# Altium schematic sheet DM2097_TopLevel.SchDoc: =project_title
size Tabloid; PageSetup: Record=PageOptions|CenterHorizontal=True|CenterVertical=True|PrintScale=0.73|XCorrection=1.00|YCorrection=1.00|PrintKind=0|BorderSize=5000000|LeftOffset=0|BottomOffset=0|Orientation=2|PaperLength=1000|PaperWidth=1000|Scale=100|PaperSource=7|PrintQuality=-4|MediaType=1|DitherType=10|PaperKind=A4|PrintScaleMode=1; CompanyName: Luxonis Holding; Organization: Luxonis Holding; Address1: 1925 Harmony Park Drive; Address2: Westminster, CO; Address3: 80234; Address4: United States; SheetNumber: 2; SheetTotal: 17
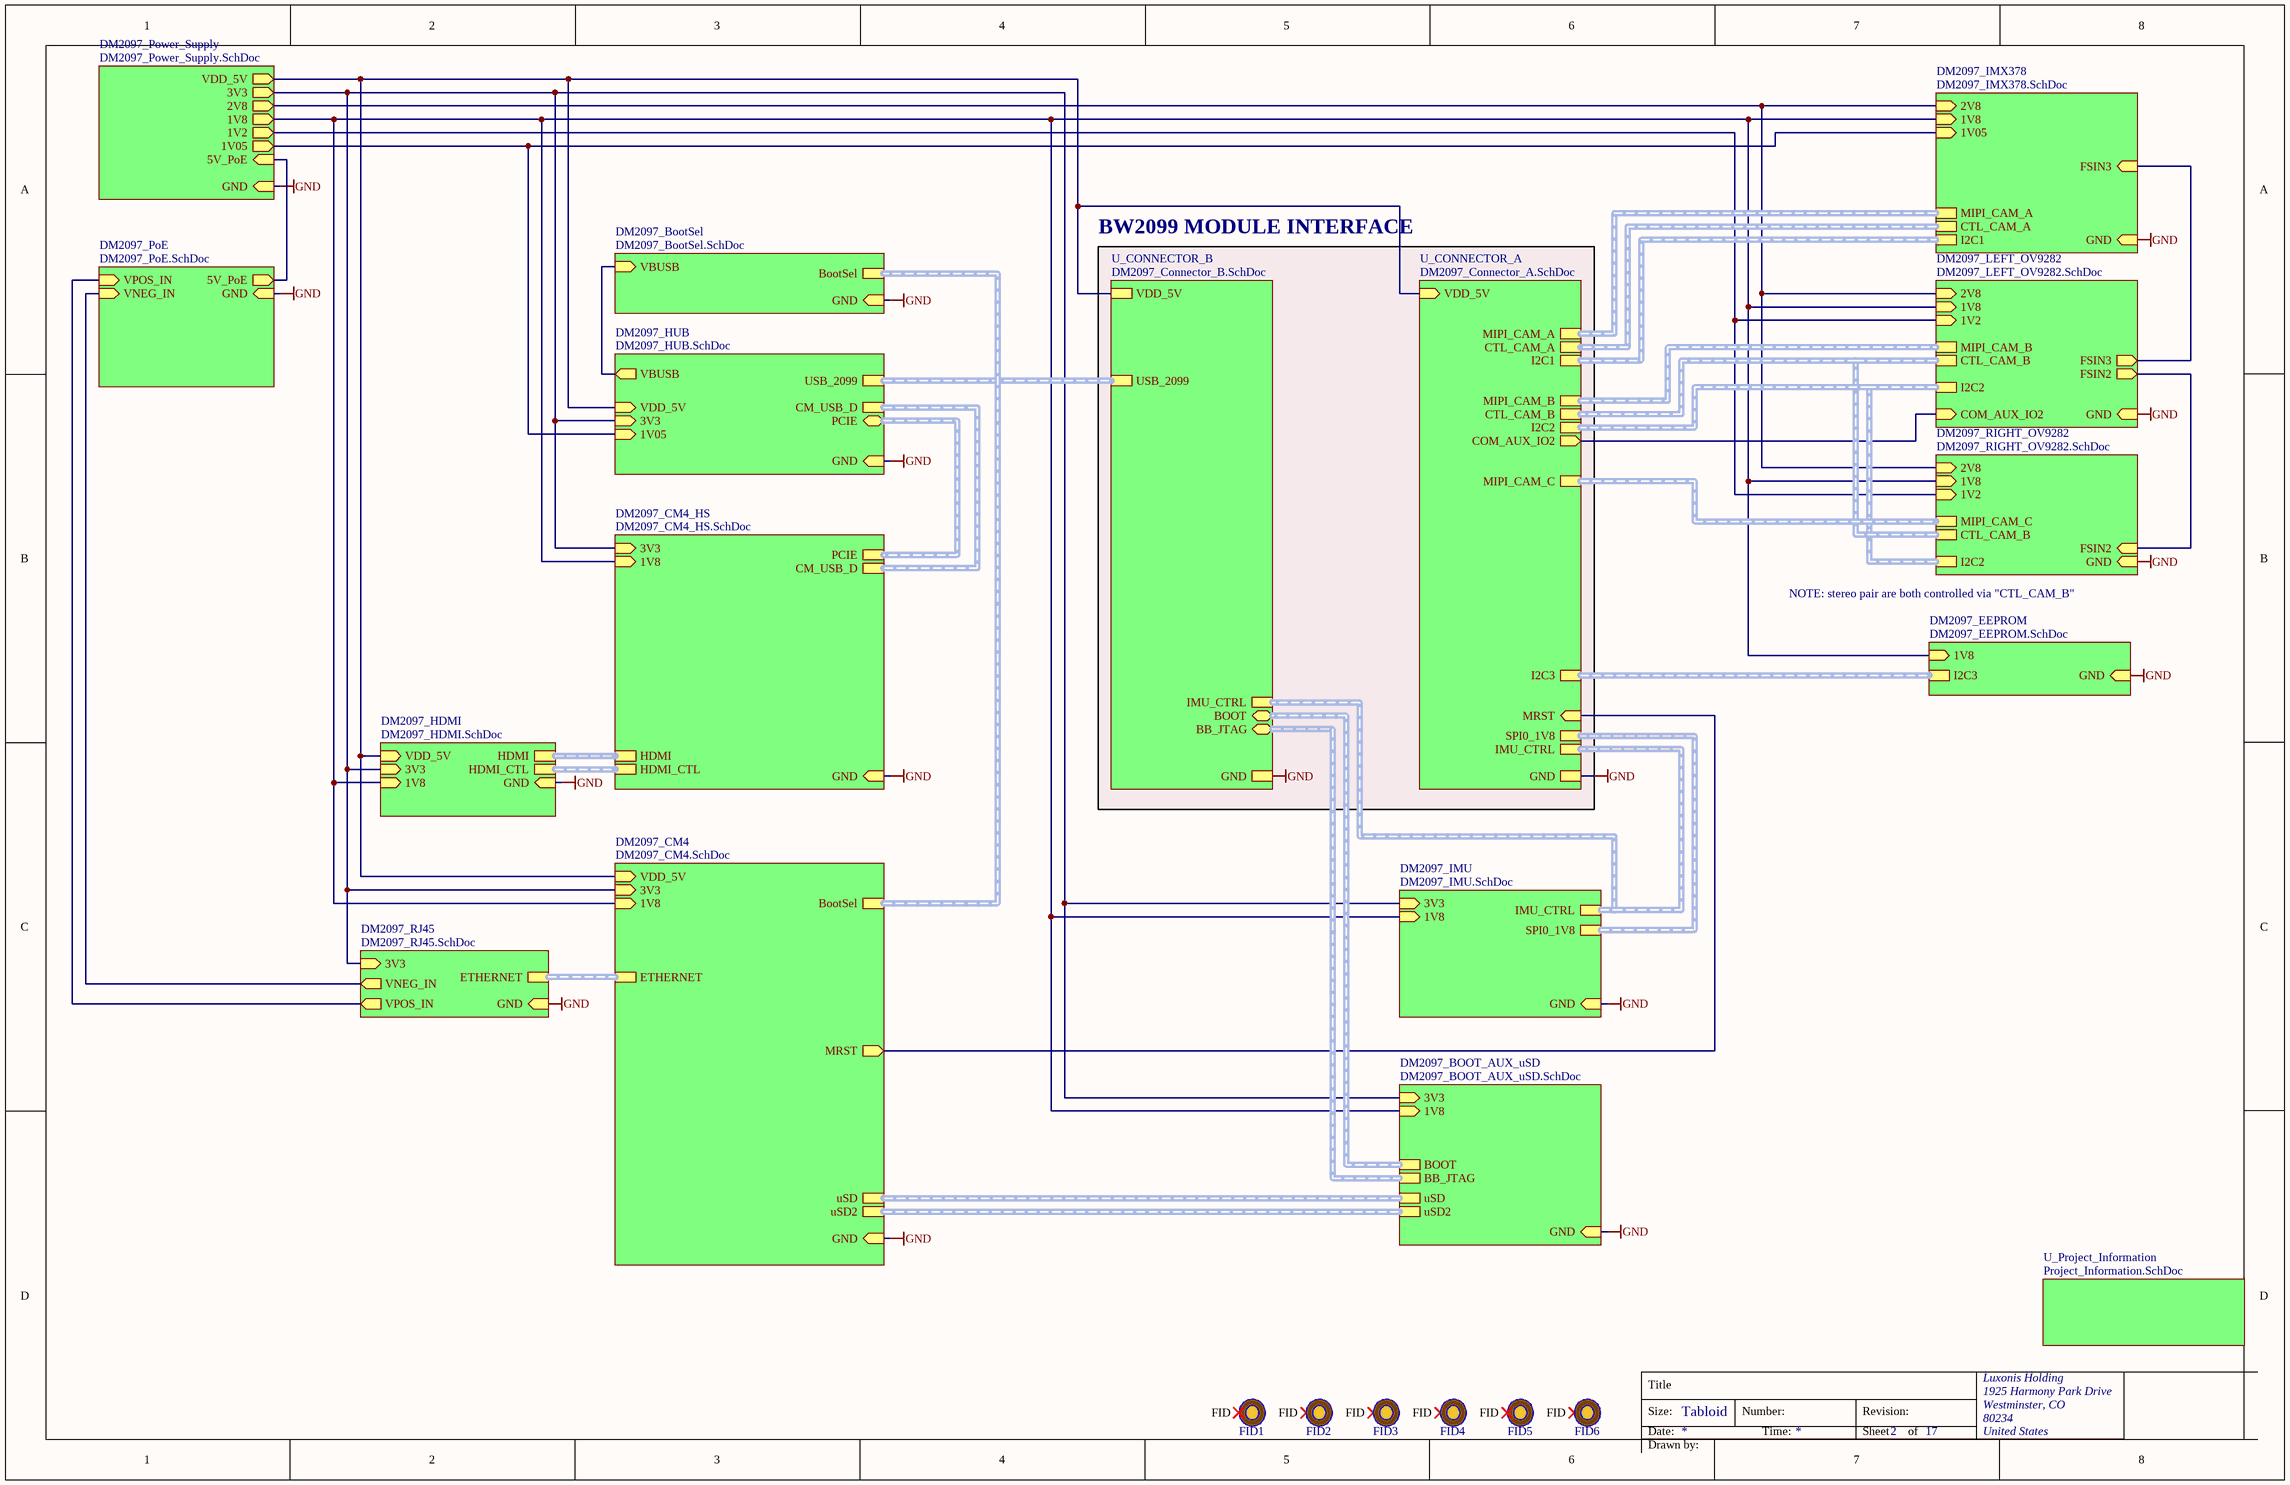
[diagram p0: DM2097_TopLevel.SchDoc]

## Parts
FID1  FIDUCIAL_ROUND_1MM  [FIDUCIAL_ROUND_1MM]  (value not drawn)  (no BOM)
FID2  FIDUCIAL_ROUND_1MM  [FIDUCIAL_ROUND_1MM]  (value not drawn)  (no BOM)
FID3  FIDUCIAL_ROUND_1MM  [FIDUCIAL_ROUND_1MM]  (value not drawn)  (no BOM)
FID4  FIDUCIAL_ROUND_1MM  [FIDUCIAL_ROUND_1MM]  (value not drawn)  (no BOM)
FID5  FIDUCIAL_ROUND_1MM  [FIDUCIAL_ROUND_1MM]  (value not drawn)  (no BOM)
FID6  FIDUCIAL_ROUND_1MM  [FIDUCIAL_ROUND_1MM]  (value not drawn)  (no BOM)

## Sub-sheets
DM2097_BOOT_AUX_uSD = DM2097_BOOT_AUX_uSD.SchDoc: uSD (harness uSD), 3V3 (in), GND (in), BB_JTAG (harness uSD), BOOT (harness uSD), 1V8 (in), uSD2
DM2097_BootSel = DM2097_BootSel.SchDoc: VBUSB (in), BootSel (harness BootSel), GND (in)
DM2097_CM4 = DM2097_CM4.SchDoc: GND (in), 3V3 (in), VDD_5V (in), BootSel (harness BootSel), ETHERNET (harness ETHERNET), 1V8 (in), MRST (out), uSD, uSD2
DM2097_CM4_HS = DM2097_CM4_HS.SchDoc: HDMI (harness HDMI), HDMI_CTL (harness HDMI_CTL), GND (in), CM_USB_D, PCIE (harness PCIE), 3V3 (in), 1V8 (in)
DM2097_EEPROM = DM2097_EEPROM.SchDoc: GND (in), 1V8 (in), I2C3
DM2097_HDMI = DM2097_HDMI.SchDoc: HDMI_CTL (harness HDMI_CTL), HDMI (harness HDMI), 3V3 (in), GND (in), VDD_5V (in), 1V8 (in)
DM2097_HUB = DM2097_HUB.SchDoc: CM_USB_D (harness CM _USB_D), USB_2099 (harness USB_M), VDD_5V (in), 3V3 (in), GND (in), VBUSB (out), PCIE (bidir, harness Harness), 1V05 (in)
DM2097_IMU = DM2097_IMU.SchDoc: 3V3 (in), GND (in), SPI0_1V8 (harness uSD), 1V8 (in), IMU_CTRL (harness uSD)
DM2097_IMX378 = DM2097_IMX378.SchDoc: 2V8 (in), 1V05 (in), I2C1 (harness I2C1), MIPI_CAM_A (harness MIPI_CAM_A), CTL_CAM_A (harness CTL_CAM_A), GND (in), 1V8 (in), FSIN3 (in)
DM2097_LEFT_OV9282 = DM2097_LEFT_OV9282.SchDoc: I2C2 (harness I2C2), CTL_CAM_B (harness CTL_CAM_B), MIPI_CAM_B (harness MIPI_CAM_B), 1V2 (in), 2V8 (in), GND (in), 1V8 (in), FSIN2 (out), COM_AUX_IO2 (in), FSIN3 (out)
DM2097_PoE = DM2097_PoE.SchDoc: VNEG_IN (in), VPOS_IN (in), 5V_PoE (out), GND (in)
DM2097_Power_Supply = DM2097_Power_Supply.SchDoc: 1V8 (out), 2V8 (out), 1V05 (out), VDD_5V (out), GND (in), 3V3 (out), 1V2 (out), 5V_PoE (in)
DM2097_RIGHT_OV9282 = DM2097_RIGHT_OV9282.SchDoc: I2C2 (harness I2C2), 1V2 (in), 2V8 (in), GND (in), 1V8 (in), FSIN2 (in), MIPI_CAM_C (harness MIPI_CAM_C), CTL_CAM_B (harness CTL_CAM_B)
DM2097_RJ45 = DM2097_RJ45.SchDoc: 3V3 (in), ETHERNET (harness ETHERNET), GND (in), VNEG_IN (out), VPOS_IN (out)
U_CONNECTOR_A = DM2097_Connector_A.SchDoc: I2C2 (harness I2C2), I2C1 (harness I2C1), MIPI_CAM_C (harness MIPI_CAM_C), CTL_CAM_A (harness CTL_CAM_A), MIPI_CAM_A (harness MIPI_CAM_A), MIPI_CAM_B (harness MIPI_CAM_B), GND, CTL_CAM_B (harness CTL_CAM_B), COM_AUX_IO2 (out), MRST (in), SPI0_1V8, VDD_5V (in), IMU_CTRL, I2C3 (harness I2C1)
U_CONNECTOR_B = DM2097_Connector_B.SchDoc: VDD_5V, GND, BOOT (bidir, harness BOOT), BB_JTAG (bidir, harness BB_JTAG), USB_2099, IMU_CTRL
U_Project_Information = Project_Information.SchDoc: no entries

## Nets
GND: sheet DM2097_IMX378/GND, sheet DM2097_CM4/GND, sheet DM2097_BOOT_AUX_uSD/GND, sheet DM2097_BootSel/GND, sheet DM2097_HUB/GND, sheet DM2097_RJ45/GND, sheet DM2097_RIGHT_OV9282/GND, sheet DM2097_LEFT_OV9282/GND, sheet DM2097_Power_Supply/GND, sheet DM2097_HDMI/GND, sheet DM2097_CM4_HS/GND, sheet DM2097_PoE/GND, sheet U_CONNECTOR_B/GND, sheet U_CONNECTOR_A/GND, sheet DM2097_IMU/GND, sheet DM2097_EEPROM/GND
(unnamed): sheet DM2097_IMX378/2V8, sheet DM2097_RIGHT_OV9282/2V8, sheet DM2097_LEFT_OV9282/2V8, sheet DM2097_Power_Supply/2V8
(unnamed): sheet DM2097_IMX378/1V05, sheet DM2097_HUB/1V05, sheet DM2097_Power_Supply/1V05
(unnamed): sheet DM2097_IMX378/1V8, sheet DM2097_CM4/1V8, sheet DM2097_BOOT_AUX_uSD/1V8, sheet DM2097_RIGHT_OV9282/1V8, sheet DM2097_LEFT_OV9282/1V8, sheet DM2097_Power_Supply/1V8, sheet DM2097_HDMI/1V8, sheet DM2097_CM4_HS/1V8, sheet DM2097_IMU/1V8, sheet DM2097_EEPROM/1V8
(unnamed): sheet DM2097_IMX378/FSIN3, sheet DM2097_LEFT_OV9282/FSIN3
(unnamed): sheet DM2097_CM4/3V3, sheet DM2097_BOOT_AUX_uSD/3V3, sheet DM2097_HUB/3V3, sheet DM2097_RJ45/3V3, sheet DM2097_Power_Supply/3V3, sheet DM2097_HDMI/3V3, sheet DM2097_CM4_HS/3V3, sheet DM2097_IMU/3V3
(unnamed): sheet DM2097_CM4/VDD_5V, sheet DM2097_HUB/VDD_5V, sheet DM2097_Power_Supply/VDD_5V, sheet DM2097_HDMI/VDD_5V, sheet U_CONNECTOR_B/VDD_5V, sheet U_CONNECTOR_A/VDD_5V
(unnamed): sheet DM2097_CM4/MRST, sheet U_CONNECTOR_A/MRST
(unnamed): sheet DM2097_BootSel/VBUSB, sheet DM2097_HUB/VBUSB
(unnamed): sheet DM2097_RJ45/VNEG_IN, sheet DM2097_PoE/VNEG_IN
(unnamed): sheet DM2097_RJ45/VPOS_IN, sheet DM2097_PoE/VPOS_IN
(unnamed): sheet DM2097_RIGHT_OV9282/1V2, sheet DM2097_LEFT_OV9282/1V2, sheet DM2097_Power_Supply/1V2
(unnamed): sheet DM2097_RIGHT_OV9282/FSIN2, sheet DM2097_LEFT_OV9282/FSIN2
(unnamed): sheet DM2097_LEFT_OV9282/COM_AUX_IO2, sheet U_CONNECTOR_A/COM_AUX_IO2
(unnamed): sheet DM2097_Power_Supply/5V_PoE, sheet DM2097_PoE/5V_PoE

Not connected (* = marked no-connect by the designer): FID1 FID*; FID2 FID*; FID3 FID*; FID4 FID*; FID5 FID*; FID6 FID*

## Buses and harness runs
harness sheet DM2097_BOOT_AUX_uSD/BB_JTAG = sheet U_CONNECTOR_B/BB_JTAG
harness sheet DM2097_BOOT_AUX_uSD/BOOT = sheet U_CONNECTOR_B/BOOT
harness sheet DM2097_BOOT_AUX_uSD/uSD2 = sheet DM2097_CM4/uSD2
harness sheet DM2097_BOOT_AUX_uSD/uSD = sheet DM2097_CM4/uSD
harness sheet DM2097_BootSel/BootSel = sheet DM2097_CM4/BootSel
harness sheet DM2097_CM4/ETHERNET = sheet DM2097_RJ45/ETHERNET
harness sheet DM2097_CM4_HS/CM_USB_D = sheet DM2097_HUB/CM_USB_D
harness sheet DM2097_CM4_HS/HDMI = sheet DM2097_HDMI/HDMI
harness sheet DM2097_CM4_HS/HDMI_CTL = sheet DM2097_HDMI/HDMI_CTL
harness sheet DM2097_CM4_HS/PCIE = sheet DM2097_HUB/PCIE
harness sheet DM2097_EEPROM/I2C3 = sheet U_CONNECTOR_A/I2C3
harness sheet DM2097_HUB/USB_2099 = sheet U_CONNECTOR_B/USB_2099
harness sheet DM2097_IMU/IMU_CTRL = sheet U_CONNECTOR_A/IMU_CTRL = sheet U_CONNECTOR_B/IMU_CTRL
harness sheet DM2097_IMU/SPI0_1V8 = sheet U_CONNECTOR_A/SPI0_1V8
harness sheet DM2097_IMX378/CTL_CAM_A = sheet U_CONNECTOR_A/CTL_CAM_A
harness sheet DM2097_IMX378/I2C1 = sheet U_CONNECTOR_A/I2C1
harness sheet DM2097_IMX378/MIPI_CAM_A = sheet U_CONNECTOR_A/MIPI_CAM_A
harness sheet DM2097_LEFT_OV9282/CTL_CAM_B = sheet DM2097_RIGHT_OV9282/CTL_CAM_B = sheet U_CONNECTOR_A/CTL_CAM_B
harness sheet DM2097_LEFT_OV9282/I2C2 = sheet DM2097_RIGHT_OV9282/I2C2 = sheet U_CONNECTOR_A/I2C2
harness sheet DM2097_LEFT_OV9282/MIPI_CAM_B = sheet U_CONNECTOR_A/MIPI_CAM_B
harness sheet DM2097_RIGHT_OV9282/MIPI_CAM_C = sheet U_CONNECTOR_A/MIPI_CAM_C

## Notes on the sheet
- BW2099 MODULE INTERFACE
- NOTE: stereo pair are both controlled via "CTL_CAM_B"
- Title
- Size:
- Date:
- Tabloid
- Number:
- Time:
- Revision:
- Sheet
- of
- Drawn by:

## Library data of the parts
FID1-FID6 = FIDUCIAL: Fiducial with various available footprints